# EAGLE design ColorBar (EAGLE 6.5.0)
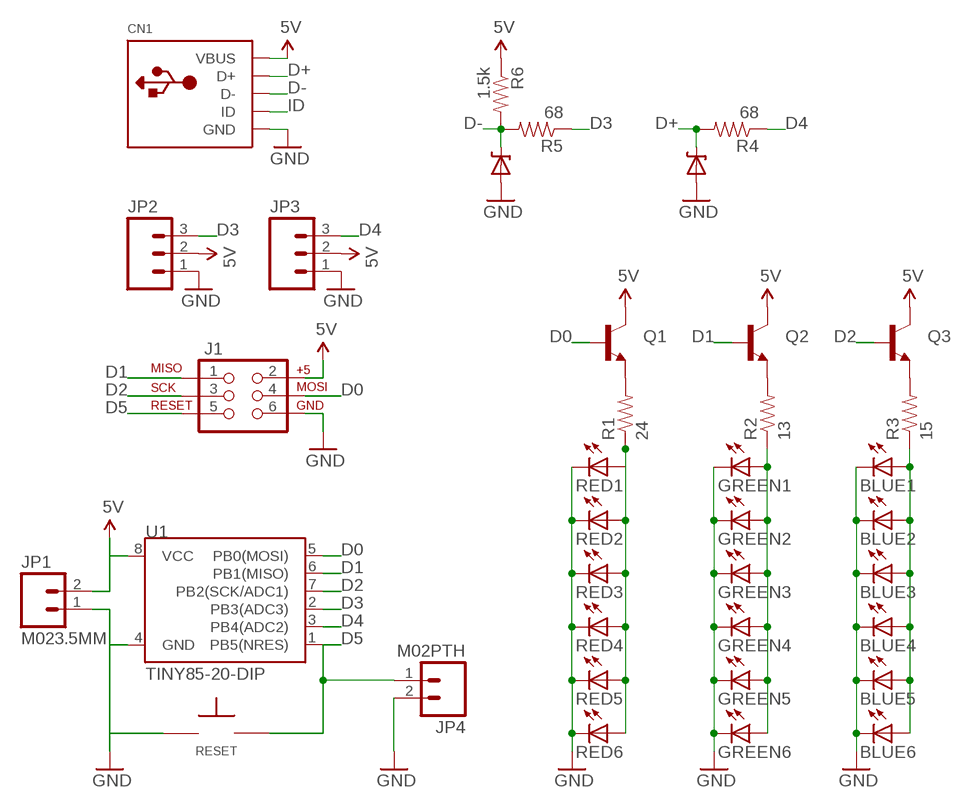
[diagram p0: schematic, sheet 1]

## Parts
BLUE1  LEDOVAL  [LED-OVAL]
BLUE2  LEDOVAL  [LED-OVAL]
BLUE3  LEDOVAL  [LED-OVAL]
BLUE4  LEDOVAL  [LED-OVAL]
BLUE5  LEDOVAL  [LED-OVAL]
BLUE6  LEDOVAL  [LED-OVAL]
CN1  USBMOLEX  [USB-MINIB-THM-MOLEX]
GREEN1  LEDOVAL  [LED-OVAL]
GREEN2  LEDOVAL  [LED-OVAL]
GREEN3  LEDOVAL  [LED-OVAL]
GREEN4  LEDOVAL  [LED-OVAL]
GREEN5  LEDOVAL  [LED-OVAL]
GREEN6  LEDOVAL  [LED-OVAL]
J1  AVR_SPI_PRG_6LABELED  [2X3-NS]
JP1  M023.5MM  [SCREWTERMINAL-3.5MM-2]
JP2  M03PTH  [1X03]
JP3  M03PTH  [1X03]
JP4  M02PTH  [1X02]
Q1  TRANSISTOR_NPNTO-92-AMMO  [TO-92-AMMO]
Q2  TRANSISTOR_NPNTO-92-AMMO  [TO-92-AMMO]
Q3  TRANSISTOR_NPNTO-92-AMMO  [TO-92-AMMO]
R1  24  RESISTORAXIAL-0.3  [AXIAL-0.3]
R2  13  RESISTORAXIAL-0.3  [AXIAL-0.3]
R3  15  RESISTORAXIAL-0.3  [AXIAL-0.3]
R4  68  RESISTORAXIAL-0.3  [AXIAL-0.3]
R5  68  RESISTORAXIAL-0.3  [AXIAL-0.3]
R6  1.5k  RESISTORAXIAL-0.3  [AXIAL-0.3]
RED1  LEDOVAL  [LED-OVAL]
RED2  LEDOVAL  [LED-OVAL]
RED3  LEDOVAL  [LED-OVAL]
RED4  LEDOVAL  [LED-OVAL]
RED5  LEDOVAL  [LED-OVAL]
RED6  LEDOVAL  [LED-OVAL]
RESET  TAC_SPST_NO  [TAC_SPST_NO]
U1  TINY85-20-DIP  ATTINY45TINY85-20-DIP  [DIP08]
U$1  3.6  DIODE-ZENERPTH  [DIODE-ZENER]
U$2  3.6  DIODE-ZENERPTH  [DIODE-ZENER]

## Nets
5V: CN1.VBUS J1.2(V+) JP1.2 JP2.2 JP3.2 Q1.3(C) Q2.3(C) Q3.3(C) R6.P$1 U1.8(VCC)
BLUE: BLUE1.ANODE(A) BLUE2.ANODE(A) BLUE3.ANODE(A) BLUE4.ANODE(A) BLUE5.ANODE(A) BLUE6.ANODE(A) R3.P$1
D0: J1.4(MOSI) Q1.2(B) U1.5(PB0(MOSI))
D1: J1.1(MISO) Q2.2(B) U1.6(PB1(MISO))
D2: J1.3(SCK) Q3.2(B) U1.7(PB2(SCK/ADC1))
D3: JP2.3 R5.P$1 U1.2(PB3(ADC3))
D4: JP3.3 R4.P$1 U1.3(PB4(ADC2))
D5: J1.5(RST) JP4.1 RESET.P$2 U1.1(PB5(NRES))
D+: CN1.D+ R4.P$2 U$2.P$1(C)
D-: CN1.D- R5.P$2 R6.P$2 U$1.P$1(C)
GND: BLUE1.CATHODE(C) BLUE2.CATHODE(C) BLUE3.CATHODE(C) BLUE4.CATHODE(C) BLUE5.CATHODE(C) BLUE6.CATHODE(C) CN1.GND GREEN1.CATHODE(C) GREEN2.CATHODE(C) GREEN3.CATHODE(C) GREEN4.CATHODE(C) GREEN5.CATHODE(C) GREEN6.CATHODE(C) J1.6(GND) JP1.1 JP2.1 JP3.1 JP4.2 RED1.CATHODE(C) RED2.CATHODE(C) RED3.CATHODE(C) RED4.CATHODE(C) RED5.CATHODE(C) RED6.CATHODE(C) RESET.P$1 U1.4(GND) U$1.P$2(A) U$2.P$2(A)
GREEN: GREEN1.ANODE(A) GREEN2.ANODE(A) GREEN3.ANODE(A) GREEN4.ANODE(A) GREEN5.ANODE(A) GREEN6.ANODE(A) R2.P$1
ID: CN1.ID
N$1: Q1.1(E) R1.P$2
N$2: Q2.1(E) R2.P$2
N$5: Q3.1(E) R3.P$2
RED: R1.P$1 RED1.ANODE(A) RED2.ANODE(A) RED3.ANODE(A) RED4.ANODE(A) RED5.ANODE(A) RED6.ANODE(A)

## Library data of the parts
BLUE1-BLUE6 GREEN1-GREEN6 RED1-RED6 = barbary_enterprises:LED: LEDs Standard schematic elements and footprints for 5mm, 3mm, 1206, and 0603 sized LEDs. 5mm - Spark Fun Electronics SKU : COM-00529 (and others)
CN1 = barbary_enterprises:USB: USB Connectors USBMINIB - Surface Mount Female Mini-B USB Connector 4UConnector: 06564 By microbuilder.eu Thru-hole RA Female Mini-B USB Connector 4UConnector: 18732 By ladyada.net
J1 = barbary_enterprises:AVR_SPI_PRG_6: AVR ISP 6 Pin This is the reduced ISP connector for AVR programming. Common on Arduino. This footprint will take up less PCB space and can be used with a 10-pin to 6-pin adapter such as SKU: BOB-08508
JP1 JP4 = SparkFun-Connectors:M02: Standard 2-pin 0.1" header. Use with - straight break away headers ( PRT-00116) - right angle break away headers (PRT-00553) - swiss pins (PRT-00743) - machine pins (PRT-00117) - female headers (PRT-00115) Molex polarized connector foot print use with: PRT-08233 with associated crimp pins and housings. 2.54_SCREWTERM for use with PRT-10571. 3.5mm Screw Terminal footprints for PRT-08084 5mm Screw Terminal footprints for use with PRT-08433
JP2 JP3 = SparkFun-Connectors:M03: Header 3 Standard 3-pin 0.1" header. Use with straight break away headers (SKU : PRT-00116), right angle break away headers (PRT-00553), swiss pins (PRT-00743), machine pins (PRT-00117), and female headers (PRT-00115). Molex polarized connector foot print use with SKU : PRT-08232 with associated crimp pins and housings.
Q1-Q3 = barbary_enterprises:TRANSISTOR_NPN: Generic NPN BJT MMBT2222A - TRANS-08049 (SOT-23, 1A 40V) MPSA42 - TRANS-09116 (SOT-23, 500mA 300V) MMBT5088LT1G - TRANS-11160 (SOT-23, 50 mA 30V)
R1-R6 = barbary_enterprises:RESISTOR: Resistor Basic schematic elements and footprints for 0603, 1206, and PTH resistors.
RESET = barbary_enterprises:TAC_SPST_NO: 3,5 mm Tact Switches C&K PTS635 Series * Digi-Key Part Number: CKN9102-ND
U1 = SparkFun-DigitalIC:ATTINY45: Atmel 8-pin 2/4/8kB flash uC; PROD_ID: IC-09445
U$1 U$2 = SparkFun-DiscreteSemi:DIODE-ZENER: Zener Diode Production Part - 8199 3.4V Zener Voltage

## Board
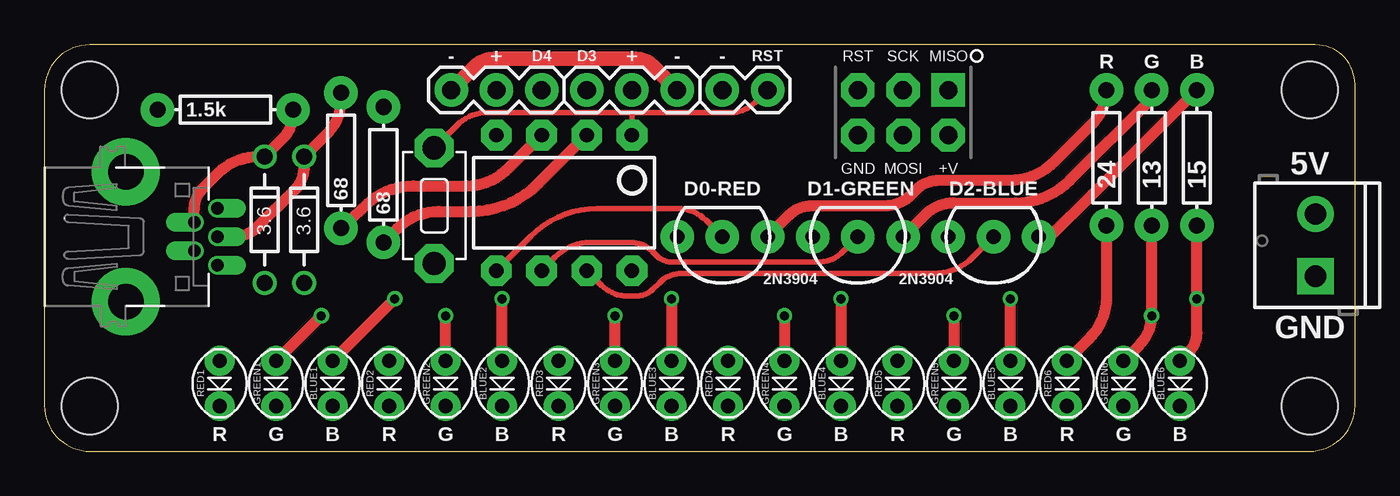
[diagram p1: board, top side]
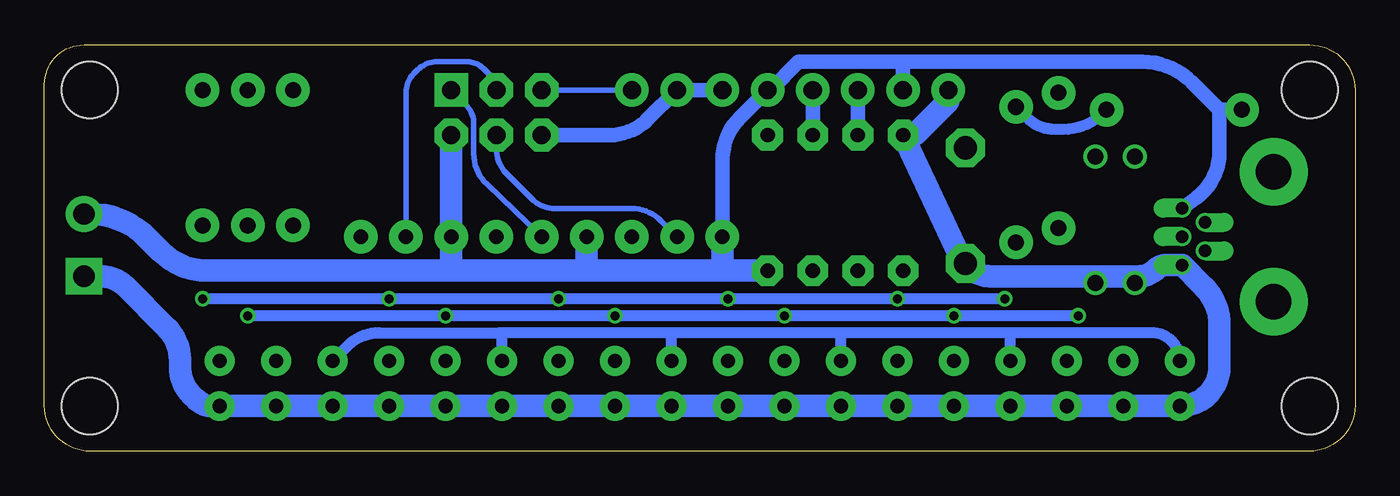
[diagram p2: board, bottom side, seen from below]

Size 73.66 x 22.86 mm. Coordinates in mm from the lower left corner, seen from the top.
Outline: 0,20.32 0,2.56 arc90 2.56,0 71.1,0 arc90 73.66,2.56 73.66,20.64 arc90 71.44,22.86 2.54,22.86 arc90 0,20.32
Copper layers (1*16): Top 0.0356mm / dielectric 1.5011mm / Bottom 0.0356mm
Design rules "LaenPCBOrder": minimum track width 6mil, minimum drill 13mil, track to track 6mil, track to pad 6mil, pad to pad 6mil, via to via 6mil, smd to smd 6mil, copper to edge 15mil, drill to drill 6mil, minimum pad ring 7mil, minimum via ring 7mil, stop-mask expansion 3mil, vias tented up to drill 0mil, thermal gap 10mil
Holes 3.17 mm at 2.54,2.54 71.12,2.54 71.12,20.32 2.54,20.32

### Footprints (pad centres in the part's own frame; a part is rotated, then mirrored left to right if it is on the bottom)
LED-OVAL = drill 0.8 pad 1.676: ANODE 1.27,0; CATHODE -1.27,0
USB-MINIB-THM-MOLEX = drill 0.7 offset: D+ 0,9.72; D- -0.8,8.42; GND 1.6,9.72; ID 0.8,8.42; VBUS -1.6,9.72 | drill 2 pad 3.81: GND1 -3.65,4.57; GND4 3.65,4.57
2X3-NS = drill 1.016 pad 1.88 square: 1 -2.54,-1.27 | drill 1.016 pad 1.88 octagon: 2 -2.54,1.27; 3 0,-1.27; 4 0,1.27; 5 2.54,-1.27; 6 2.54,1.27
SCREWTERMINAL-3.5MM-2 = drill 1.2 pad 2.032 square: 1 0,0 | drill 1.2 pad 2.032: 2 3.5,0
1X03 = drill 1.016 pad 1.88: 1 0,0; 2 2.54,0; 3 5.08,0
1X02 = drill 1.016 pad 1.88: 1 0,0; 2 2.54,0
TO-92-AMMO = drill 0.813 pad 1.88: 1 -2.54,0; 2 0,0; 3 2.54,0
AXIAL-0.3 = drill 0.9 pad 1.88: P$1 -3.81,0; P$2 3.81,0
TAC_SPST_NO = drill 1.3 pad 2.184 octagon: P$1 -3.251,0; P$2 3.251,0
DIP08 = drill 0.813 pad 1.727 octagon: 1 -3.81,-3.81; 2 -1.27,-3.81; 3 1.27,-3.81; 4 3.81,-3.81; 5 3.81,3.81; 6 1.27,3.81; 7 -1.27,3.81; 8 -3.81,3.81
DIODE-ZENER = drill 0.9: P$1 -3.556,0; P$2 3.556,0

### Placement (x,y rotation side)
BLUE1  16.19,3.81 90 top
BLUE2  25.72,3.81 90 top
BLUE3  35.24,3.81 90 top
BLUE4  44.77,3.81 90 top
BLUE5  54.29,3.81 90 top
BLUE6  63.82,3.81 90 top
CN1  0,12.06 270 top
GREEN1  13.02,3.81 90 top
GREEN2  22.54,3.81 90 top
GREEN3  32.07,3.81 90 top
GREEN4  41.59,3.81 90 top
GREEN5  51.12,3.81 90 top
GREEN6  60.64,3.81 90 top
J1  48.26,19.05 180 top
JP1  71.44,9.84 90 top
JP2  35.56,20.32 180 top
JP3  22.86,20.32 0 top
JP4  40.64,20.32 180 top
Q1  38.1,12.06 180 top
Q2  45.72,12.06 180 top
Q3  53.34,12.06 180 top
R1  59.69,16.51 90 top
R2  62.23,16.51 90 top
R3  64.77,16.51 90 top
R4  16.67,16.35 90 top
R5  19.05,15.56 90 top
R6  10.16,19.21 0 top
RED1  9.84,3.81 90 top
RED2  19.37,3.81 90 top
RED3  28.89,3.81 90 top
RED4  38.42,3.81 90 top
RED5  47.94,3.81 90 top
RED6  57.47,3.81 90 top
RESET  21.91,13.81 90 top
U1  29.21,13.97 180 top
U$1  12.38,13.02 270 top
U$2  14.61,13.02 270 top

### Tracks (layer width: path | path; a pad name or v marks a point on that pad's centre or on a via)
5V
  Bottom 0.61: 7.46,19.21 7.62,19.05
  Bottom 0.813: 35.4,10.16 35.56,10.32 35.56,16.34 arc45 34.54,18.8 JP2.2 32.86,20.32 31.27,21.91 25.4,21.91 | JP3.2 25.4,21.91 | 25.4,21.91 11.95,21.91 arc45 9.17,20.76 7.62,19.21 7.62,19.05 7.62,16.81 arc54 8.9,14.27 CN1.VBUS | R6.P$1 7.46,19.21
  Bottom 1.27: U1.8 35.4,10.16 35.56,10.16 | 35.56,10.16 43.18,10.16 | 43.18,10.16 50.8,10.16 | 50.8,10.16 64.55,10.16 arc45 67.09,11.21 67.9,12.02 arc-45 71.09,13.34 JP1.2 | Q1.3 35.56,10.16 | Q2.3 43.18,10.16 | 50.8,10.16 Q3.3 J1.2
BLUE  (via drill 0.51)
  Top 0.61: BLUE2.ANODE v25.72,8.57 | BLUE1.ANODE v19.68,8.57 | v35.24,8.57 BLUE3.ANODE | v44.77,8.57 BLUE4.ANODE | BLUE6.ANODE 64.34,5.6 arc45 64.77,6.64 v64.77,8.57 R3.P$1 | BLUE5.ANODE v54.29,8.57
  Bottom 0.61: v19.68,8.57 v25.72,8.57 v35.24,8.57 v44.77,8.57 v54.29,8.57 v64.77,8.57
D0
  Top 0.305: Q1.2 37.17,12.99 arc45 35.58,13.65 31.08,13.65 arc45 27.35,12.11 U1.5
  Bottom 0.305: J1.4 48.26,16.98 arc-45 47.7,15.63 46.28,14.21 arc-45 44.93,13.65 40.66,13.65 arc45 39,12.96 Q1.2
D1
  Top 0.305: Q2.2 44.88,11.23 arc-45 43.45,10.64 35.32,10.64 arc-45 34.37,11.03 34.15,11.25 arc45 32.96,11.75 30.69,11.75 arc45 28.7,10.93 U1.6
  Bottom 0.305: J1.1 49.99,19.52 arc45 49.53,18.39 49.53,16.73 arc-46 48.8,15.01 Q2.2
D2
  Top 0.305: U1.7 31.32,9.32 arc45 32.75,8.73 33.3,8.73 arc45 34.17,9.09 34.56,9.48 arc-45 35.83,10 50.02,10 arc45 52.16,10.89 Q3.2
  Bottom 0.305: Q3.2 53.34,20.19 arc45 52.91,21.23 52.69,21.45 arc45 51.58,21.91 49.9,21.91 arc45 49.01,21.54 48.26,20.79 J1.3
D3
  Top 0.61: R5.P$1 19.84,12.54 arc-45 22.15,13.49 23.96,13.49 arc45 27.77,15.07 U1.2
  Bottom 0.813: U1.2 JP2.3
D4
  Top 0.61: R4.P$1 18.17,13.94 arc-43 20.73,14.92 23.73,14.92 arc45 26.11,15.95 U1.3
  Bottom 0.813: U1.3 JP3.3
D5
  Top 0.305: U1.1 33.02,19.05 | 33.02,19.05 24.91,19.05 arc45 23.16,18.32 RESET.P$2 | JP4.1 39.93,19.61 arc-45 38.58,19.05 33.02,19.05
  Bottom 0.305: JP4.1 J1.5
D+
  Top 0.61: 10.64,12.06 arc45 11.99,12.62 14.05,14.68 arc45 14.61,16.03 U$2.P$1 15.9,17.86 arc45 16.67,19.73 R4.P$2
  Top 1.016: CN1.D+ 10.64,12.06
D-
  Top 0.61: CN1.D- 8.42,13.63 arc-45 8.89,14.76 9.79,15.66 arc-45 11.99,16.57 U$1.P$1 13.38,17.57 arc45 13.97,18.99 R6.P$2
  Bottom 0.61: 14.15,19.03 arc45 16.4,18.1 16.86,18.1 arc45 18.43,18.75 R5.P$2
  Bottom 0.813: R6.P$2 14.15,19.03
GND
  Top 0.813: JP2.1 34.24,21.64 arc45 33.21,22.07 25.3,22.07 arc45 24.11,21.57 JP3.1
  Bottom 0.305: 12.22,9.62 12.22,9.84 | 14.45,9.62 14.45,9.84
  Bottom 0.813: JP2.1 JP4.2 39.75,18.67 arc45 41.9,17.78 J1.6
  Bottom 1.016: U$1.P$2 12.22,9.62 | U$2.P$2 14.45,9.62
  Bottom 1.27: JP3.1 22.86,19.68 24.77,17.78 U1.4 22.07,10.64 RESET.P$1 21.84,10.46 21.91,10.48 21.83,10.4 arc-45 20.48,9.84 14.45,9.84 12.22,9.84 12.13,9.84 arc-45 11.21,10.22 arc45 10.62,10.46 CN1.GND 8.52,9.26 arc45 7.62,7.09 7.62,4.76 arc90 RED1.CATHODE GREEN1.CATHODE BLUE1.CATHODE RED2.CATHODE GREEN2.CATHODE BLUE2.CATHODE RED3.CATHODE GREEN3.CATHODE BLUE3.CATHODE RED4.CATHODE GREEN4.CATHODE BLUE4.CATHODE RED5.CATHODE GREEN5.CATHODE BLUE5.CATHODE RED6.CATHODE GREEN6.CATHODE BLUE6.CATHODE 64.24,2.54 arc45 65.14,2.92 65.39,3.16 arc45 66.04,4.73 66.04,5.14 arc-45 66.78,6.93 69.13,9.29 arc-45 70.48,9.84 JP1.1
GREEN  (via drill 0.51)
  Top 0.61: GREEN1.ANODE v15.56,7.62 | GREEN2.ANODE v22.54,7.62 | GREEN3.ANODE v32.07,7.62 | v41.59,7.62 GREEN4.ANODE | v51.12,7.62 GREEN5.ANODE | GREEN6.ANODE 61.56,5.99 arc45 v62.23,7.62 R2.P$1
  Bottom 0.61: v15.56,7.62 v22.54,7.62 v32.07,7.62 v41.59,7.62 v51.12,7.62 v62.23,7.62
N$1
  Top 0.61: Q1.1 41.86,13.28 arc-45 43.14,13.81 47.26,13.81 arc45 48.7,14.41 49,14.71 arc-45 50.27,15.24 54.23,15.24 arc45 56.77,16.29 58.9,18.42 arc45 R1.P$2
N$2
  Top 0.61: Q2.1 49.51,13.31 arc-45 51.09,13.97 54.59,13.97 arc45 57.61,15.22 62.23,19.84 R2.P$2
N$5
  Top 0.61: Q3.1 56.52,12.06 58.9,14.45 R3.P$2
RED
  Top 0.61: R1.P$1 59.69,8.7 arc-45 58.7,6.32 RED6.ANODE
  Bottom 0.61: RED1.ANODE arc-90 11.43,6.67 19.37,6.67 | 19.37,6.67 29.05,6.67 | 29.05,6.67 38.26,6.67 | 38.26,6.67 48.1,6.67 | RED6.ANODE 56.6,5.94 arc45 54.86,6.67 48.1,6.67 | RED2.ANODE 19.37,6.67 | RED5.ANODE 47.94,6.51 48.1,6.67 | RED4.ANODE 38.42,6.51 38.26,6.67 | RED3.ANODE 28.89,6.51 29.05,6.67

### Text on the board
tPlace: - | + | D4 | D3 | + | - | - | RST | R | G | B | 5V | D0-RED | D1-GREEN | D2-BLUE | 2N3904 | 2N3904 | GND | R | G | B | R | G | B | R | G | B | R | G | B | R | G | B | R | G | B